# EAGLE design introAu (EAGLE 6.6.0)
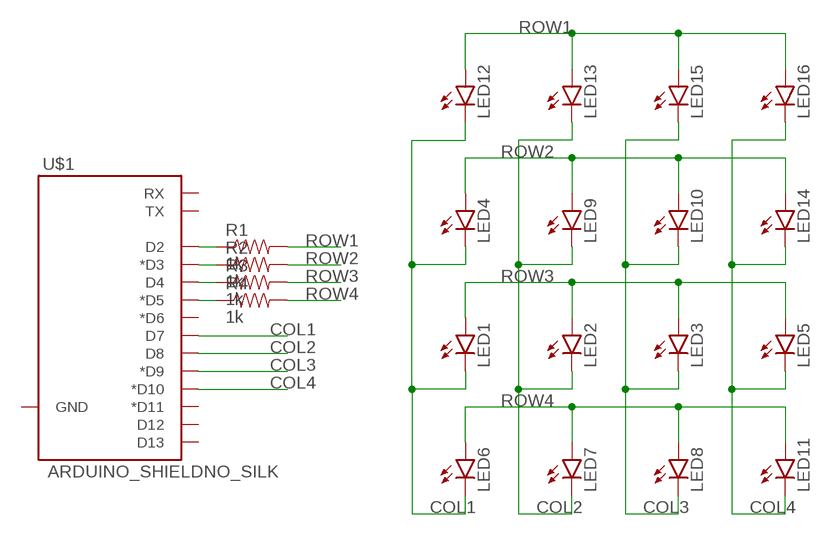
[diagram p0: schematic, sheet 1]

## Parts
LED1  LED5MM  [LED5MM]
LED2  LED5MM  [LED5MM]
LED3  LED5MM  [LED5MM]
LED4  LED5MM  [LED5MM]
LED5  LED5MM  [LED5MM]
LED6  LED5MM  [LED5MM]
LED7  LED5MM  [LED5MM]
LED8  LED5MM  [LED5MM]
LED9  LED5MM  [LED5MM]
LED10  LED5MM  [LED5MM]
LED11  LED5MM  [LED5MM]
LED12  LED5MM  [LED5MM]
LED13  LED5MM  [LED5MM]
LED14  LED5MM  [LED5MM]
LED15  LED5MM  [LED5MM]
LED16  LED5MM  [LED5MM]
R1  1k  1KOHM1/4W5%(PTH)HORIZ-KIT  [AXIAL-0.3EZ]
R2  1k  1KOHM1/4W5%(PTH)HORIZ-KIT  [AXIAL-0.3EZ]
R3  1k  1KOHM1/4W5%(PTH)HORIZ-KIT  [AXIAL-0.3EZ]
R4  1k  1KOHM1/4W5%(PTH)HORIZ-KIT  [AXIAL-0.3EZ]
U$1  ARDUINO_SHIELDNO_SILK  [DUEMILANOVE_VIAS]

## Nets
COL1: LED1.K(C) LED4.K(C) LED6.K(C) LED12.K(C) U$1.D7
COL2: LED2.K(C) LED7.K(C) LED9.K(C) LED13.K(C) U$1.D8
COL3: LED3.K(C) LED8.K(C) LED10.K(C) LED15.K(C) U$1.D9(*D9)
COL4: LED5.K(C) LED11.K(C) LED14.K(C) LED16.K(C) U$1.D10(*D10)
N$16: R1.P$1 U$1.D2
N$17: R2.P$1 U$1.D3(*D3)
N$18: R3.P$1 U$1.D4
N$19: R4.P$1 U$1.D5(*D5)
ROW1: LED12.A LED13.A LED15.A LED16.A R1.P$2
ROW2: LED4.A LED9.A LED10.A LED14.A R2.P$2
ROW3: LED1.A LED2.A LED3.A LED5.A R3.P$2
ROW4: LED6.A LED7.A LED8.A LED11.A R4.P$2
Unconnected: U$1.D6(*D6) U$1.D11(*D11) U$1.D12 U$1.D13 U$1.GND@2(GND) U$1.RX U$1.TX

## Library data of the parts
LED1-LED16 = SparkFun-LED:LED: LEDs Standard schematic elements and footprints for 5mm, 3mm, 1206, and 0603 sized LEDs. 5mm - Spark Fun Electronics SKU : COM-00529 (and others)
R1-R4 = SparkFun-Resistors:1KOHM1/4W5%(PTH): RES-08380; PROD_ID: RES-08380
U$1 = SparkFun-Boards:ARDUINO_SHIELD: Arduino shield footprint

## Board
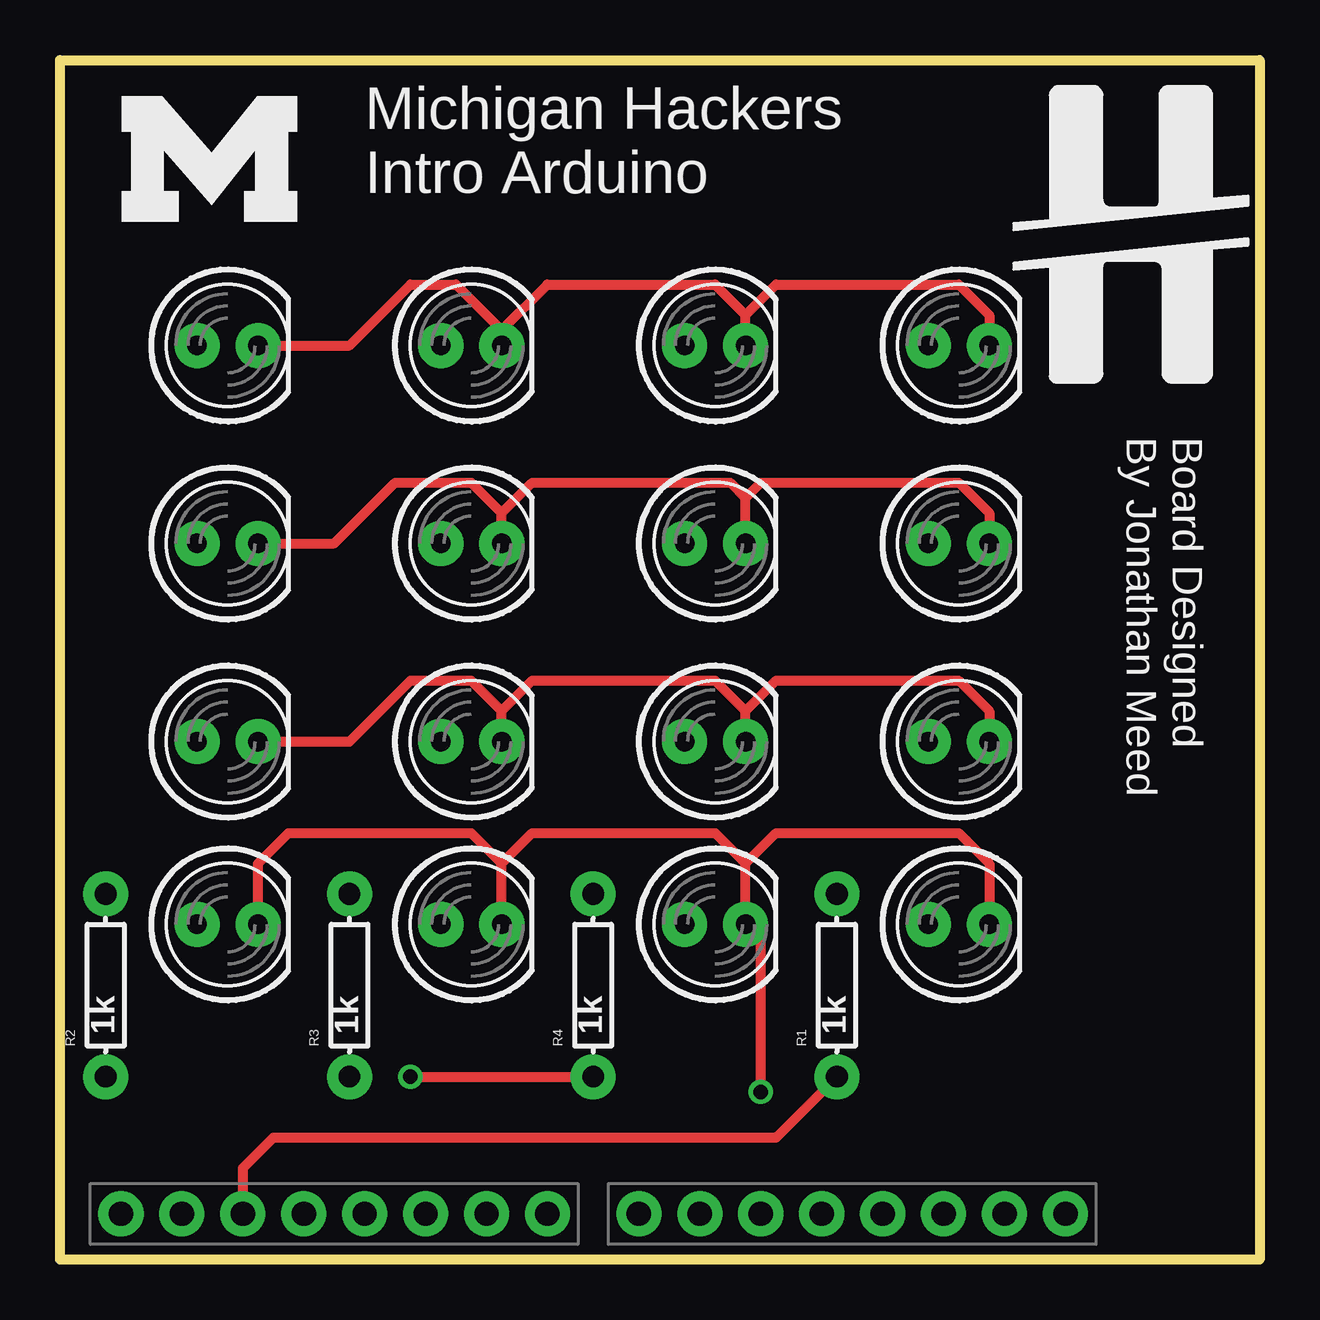
[diagram p1: board, top side]
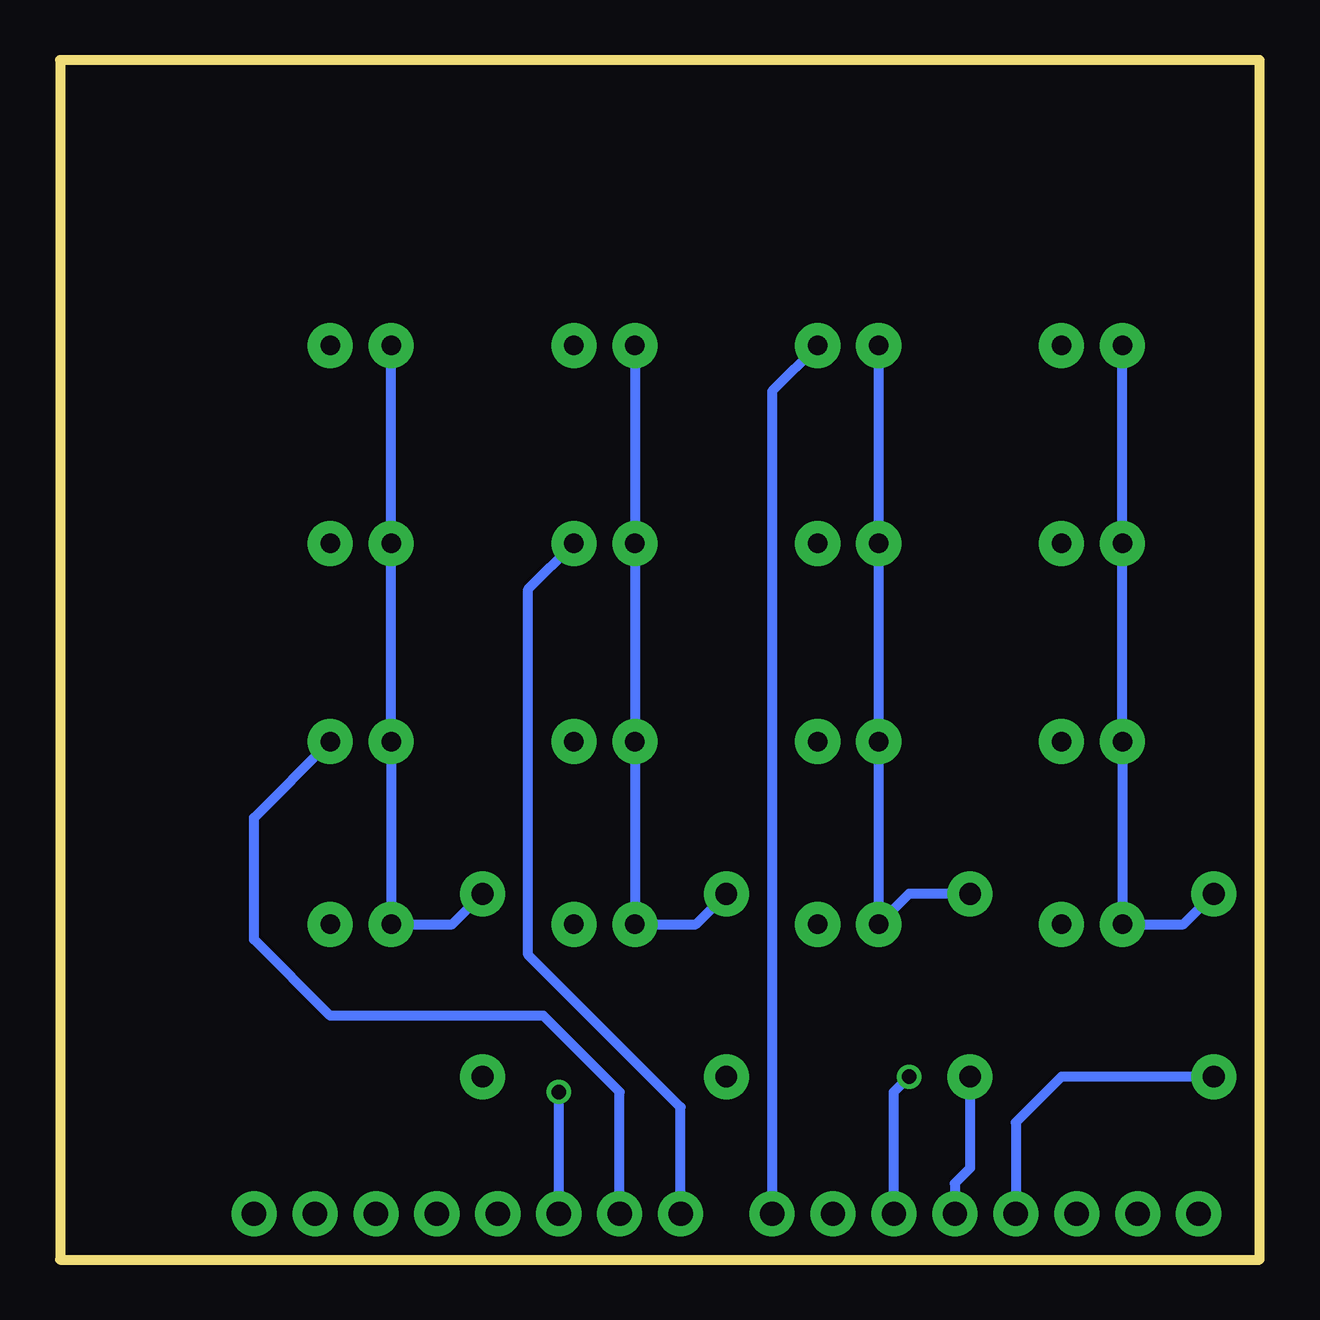
[diagram p2: board, bottom side, seen from below]

Size 50 x 50 mm. Coordinates in mm from the lower left corner, seen from the top.
Outline: 0,50 50,50 50,0 0,0 0,50
Copper layers (1*16): Top 0.035mm / dielectric 1.5mm / Bottom 0.035mm
Design rules "default": minimum track width 10mil, minimum drill 24mil, track to track 8mil, track to pad 8mil, pad to pad 8mil, via to via 8mil, smd to smd 8mil, copper to edge 40mil, drill to drill 8mil, minimum pad ring 10mil, minimum via ring 8mil, stop-mask expansion 4mil, vias tented up to drill 0mil, thermal gap 10mil

### Footprints (pad centres in the part's own frame; a part is rotated, then mirrored left to right if it is on the bottom)
LED5MM = drill 0.813 pad 1.88: A -1.27,0; K 1.27,0
AXIAL-0.3EZ = drill 0.9 pad 1.88: P$1 -3.81,0; P$2 3.81,0
DUEMILANOVE_VIAS = drill 1.016 pad 1.88: AREF 2.54,2.54; D2 2.54,36.83; D3 2.54,34.29; D4 2.54,31.75; D5 2.54,29.21; D6 2.54,26.67; D7 2.54,24.13; D8 2.54,20.32; D9 2.54,17.78; D10 2.54,15.24; D11 2.54,12.7; D12 2.54,10.16; D13 2.54,7.62; GND@2 2.54,5.08; RX 2.54,41.91; TX 2.54,39.37

### Placement (x,y rotation side)
LED1  17.14,38.1 0 top
LED2  17.14,29.84 0 top
LED3  17.14,21.59 0 top
LED4  6.99,38.1 0 top
LED5  17.14,13.97 0 top
LED6  27.3,38.1 0 top
LED7  27.3,29.84 0 top
LED8  27.3,21.59 0 top
LED9  6.99,29.84 0 top
LED10  6.99,21.59 0 top
LED11  27.3,13.97 0 top
LED12  37.47,38.1 0 top
LED13  37.47,29.84 0 top
LED14  6.99,13.97 0 top
LED15  37.47,21.59 0 top
LED16  37.47,13.97 0 top
R1  32.38,11.43 90 top
R2  1.91,11.43 90 top
R3  12.06,11.43 90 top
R4  22.23,11.43 90 top
U$1  44.45,-0.64 90 top
U$2  [SMALL-M]  3.19,42.98 0 top
U$3  [SMALL-MH]  41.27,36.83 0 top

### Tracks (layer width: path | path; a pad name or v marks a point on that pad's centre or on a via)
COL1
  Top 0.406: LED4.K 12.06,38.1 14.61,40.64 16.51,40.64 18.41,38.73 | LED1.K 18.41,38.73 | 18.41,38.73 20.32,40.64 27.3,40.64 28.57,39.37 | LED6.K 28.57,39.37 | 28.57,39.37 29.84,40.64 37.47,40.64 38.73,39.37 LED12.K
  Bottom 0.406: LED1.K 20.32,36.2 U$1.D7
COL2
  Top 0.406: LED9.K 11.43,29.84 13.97,32.38 17.14,32.38 18.41,31.11 | LED2.K 18.41,31.11 | 18.41,31.11 19.68,32.38 27.94,32.38 28.57,31.75 | LED7.K 28.57,31.75 | 28.57,31.75 29.21,32.38 37.47,32.38 38.73,31.11 LED13.K
  Bottom 0.406: U$1.D8 24.13,6.35 30.48,12.7 30.48,27.94 LED7.K
COL3
  Top 0.406: LED10.K 12.06,21.59 14.61,24.13 17.14,24.13 18.41,22.86 | LED3.K 18.41,22.86 | 18.41,22.86 19.68,24.13 27.3,24.13 28.57,22.86 | LED8.K 28.57,22.86 | 28.57,22.86 29.84,24.13 37.47,24.13 38.73,22.86 LED15.K
  Bottom 0.406: LED15.K 41.91,18.41 41.91,13.34 38.73,10.16 29.84,10.16 26.67,6.99 U$1.D9
COL4  (via drill 0.6)
  Top 0.406: LED14.K 8.26,16.51 9.53,17.78 17.14,17.78 18.41,16.51 | LED5.K 18.41,16.51 | 18.41,16.51 19.68,17.78 27.3,17.78 28.57,16.51 | 28.57,16.51 LED11.K 29.21,13.34 v29.21,6.99 | 28.57,16.51 29.84,17.78 37.47,17.78 38.73,16.51 LED16.K
  Bottom 0.406: v29.21,6.99 U$1.D10 29.21,1.27
N$16
  Top 0.406: R1.P$1 29.84,5.08 8.89,5.08 7.62,3.81 U$1.D2
N$17
  Bottom 0.406: R2.P$1 8.26,7.62 10.16,5.71 U$1.D3
N$18
  Bottom 0.406: R3.P$1 12.06,3.81 12.7,3.17 U$1.D4
N$19  (via drill 0.6)
  Top 0.406: v14.61,7.62 R4.P$1
  Bottom 0.406: U$1.D5 15.24,6.99 v14.61,7.62
ROW1
  Bottom 0.406: R1.P$2 33.66,13.97 LED16.A LED15.A LED13.A | LED13.A 36.2,30.48 | LED13.A LED12.A
ROW2
  Bottom 0.406: R2.P$2 3.17,13.97 LED14.A LED10.A LED9.A LED4.A
ROW3
  Bottom 0.406: R3.P$2 14.61,15.24 LED5.A LED3.A LED2.A LED1.A
ROW4
  Bottom 0.406: R4.P$2 23.5,13.97 LED11.A LED8.A LED7.A LED6.A

### Text on the board
tNames: Michigan Hackers / Intro Arduino | Board Designed / By Jonathan Meed